# Altium schematic sheet Raspberry.SchDoc
size A4; SheetNumber: 3; SheetTotal: 6; SPICEModelCacheFICJDGAN: <root> / <DocumentId>FICJDGAN</DocumentId> / <CacheFrame Number="0"> / <Model Name="irlz44n" Kind="CKT"> / <Text>.SUBCKT irlz44n 1 2 3 / ************************************** / *      Model Generated by MODPEX     * / *Copyright(c) Symmetry Design Systems* / *         All Rights Reserved        * / *    UNPUBLISHED LICENSED SOFTWARE   * / *   Contains Proprietary Information * / *      Which is The Property of      * / *     SYMMETRY OR ITS LICENSORS      * / *Commercial Use or Resale Restricted * / *   by Symmetry License Agreement    * / ************************************** / * Model generated on Apr 24, 96 / * Model format: SPICE3 / * Symmetry POWER MOS Model (Version 1.0) / * External Node Designations / * Node 1 -&gt; Drain / * Node 2 -&gt; Gate / * Node 3 -&gt; Source / M1 9 7 8 8 MM L=100u W=100u / * Default values used in MM: / * The voltage-dependent capacitances are / * not included. Other default values are: / *   RS=0 RD=0 LD=0 CBD=0 CBS=0 CGBO=0 / .MODEL MM NMOS LEVEL=1 IS=1e-32 / +VTO=2.08819 LAMBDA=0.0038193 KP=67.9211 / +CGSO=1.59143e-05 CGDO=3.04562e-08 / RS 8 3 0.014066 / D1 3 1 MD / .MODEL MD D IS=4.4574e-09 RS=0.007275 N=1.40246 BV=55 / +IBV=0.00025 EG=1.14011 XTI=3.00078 TT=0 / +CJO=8.92434e-10 VJ=4.94724 M=0.75496 FC=0.5 / RDS 3 1 2.2e+06 / RD 9 1 0.00179971 / RG 2 7 2.4114 / D2 4 5 MD1 / * Default values used in MD1: / *   RS=0 EG=1.11 XTI=3.0 TT=0 / *   BV=infinite IBV=1mA / .MODEL MD1 D IS=1e-32 N=50 / +CJO=1.15401e-09 VJ=0.859156 M=0.642548 FC=1e-08 / D3 0 5 MD2 / * Default values used in MD2: / *   EG=1.11 XTI=3.0 TT=0 CJO=0 / *   BV=infinite IBV=1mA / .MODEL MD2 D IS=1e-10 N=0.4 RS=3e-06 / RL 5 10 1 / FI2 7 9 VFI2 -1 / VFI2 4 0 0 / EV16 10 0 9 7 1 / CAP 11 10 3.64838e-09 / FI1 7 9 VFI1 -1 / VFI1 11 6 0 / RCAP 6 10 1 / D4 0 6 MD3 / * Default values used in MD3: / *   EG=1.11 XTI=3.0 TT=0 CJO=0 / *   RS=0 BV=infinite IBV=1mA / .MODEL MD3 D IS=1e-10 N=0.4 / .ENDS</Text> / </Model> / <Model Name="di_1n4001" Kind="MDL"> / <Text>*************************************************************************************************************************************** / *SRC=1N4001;DI_1N4001;Diodes;Si;  50.0V  1.00A  3.00us   Diodes, Inc. diode / .MODEL DI_1N4001 D  ( IS=76.9p RS=42.0m BV=50.0 IBV=5.00u / + CJO=39.8p  M=0.333 N=1.45 TT=4.32u )</Text> / </Model> / </CacheFrame> / </root>
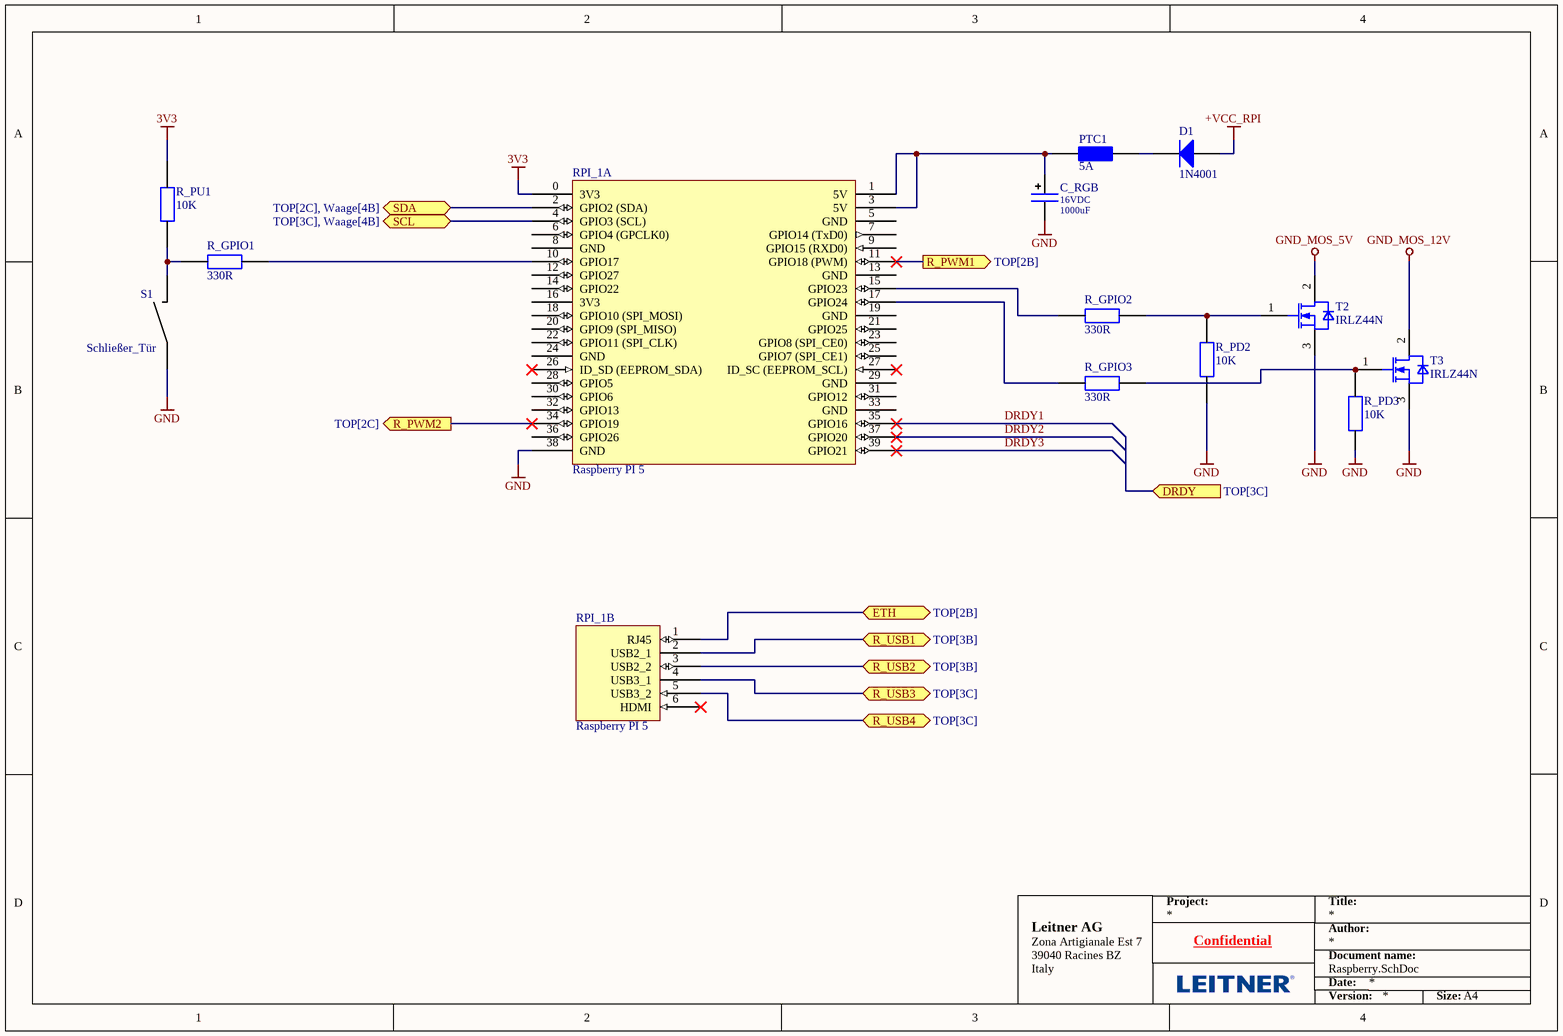
[diagram p0: Raspberry.SchDoc]

## Parts
C_RGB  Spannung: 16VDC  (hidden comment: 1000uF)
D1  1N4001  [D_DO41-RM4]
PTC1  5A
R_GPIO1  330R
R_GPIO2  330R
R_GPIO3  330R
R_PD2  10K
R_PD3  10K
R_PU1  10K
RPI_1  Raspberry PI 5  (parts A,B of 2)
S1  Schließer_Tür
T2  IRLZ44N
T3  IRLZ44N

## Ports
DRDY (in, see TOP[3C]), ETH (bidir, see TOP[2B]), R_PWM1 (out, see TOP[2B]), R_PWM2 (out, see TOP[2C]), R_USB1 (bidir, see TOP[3B]), R_USB2 (bidir, see TOP[3B]), R_USB3 (bidir, see TOP[3C]), R_USB4 (bidir, see TOP[3C]), SCL (bidir, see TOP[3C], Waage[4B]), SDA (bidir, see TOP[2C], Waage[4B])

## Nets
3V3: R_PU1.1 RPI_1.0(3V3)
+VCC_RPI: D1.A
GND: C_RGB.0 R_PD2.0 R_PD3.0 RPI_1.38(GND) T2.3(SOURCE) T3.3(SOURCE)
GND_MOS_5V: T2.2(DRAIN)
GND_MOS_12V: T3.2(DRAIN)
DRDY1: RPI_1.35(GPIO16)
DRDY2: RPI_1.37(GPIO20)
DRDY3: RPI_1.39(GPIO21)
ETH: RPI_1.1(RJ45) ; port ETH
R_PWM1: RPI_1.11(GPIO18_(PWM)) ; port R_PWM1
R_PWM2: RPI_1.34(GPIO19) ; port R_PWM2
R_USB1: RPI_1.2(USB2_1) ; port R_USB1
R_USB2: RPI_1.3(USB2_2) ; port R_USB2
R_USB3: RPI_1.4(USB3_1) ; port R_USB3
R_USB4: RPI_1.5(GND) ; port R_USB4
SCL: RPI_1.4(GPIO3_(SCL)) ; port SCL
SDA: RPI_1.2(GPIO2_(SDA)) ; port SDA
NetC_RGB_1: C_RGB.1 PTC1.0 RPI_1.1(5V) RPI_1.3(5V)
NetD1_C: D1.C(K) PTC1.1
NetR_GPIO1_0: R_GPIO1.0 R_PU1.0
NetR_GPIO1_1: R_GPIO1.1 RPI_1.10(GPIO17)
NetR_GPIO2_0: R_GPIO2.0 RPI_1.15(GPIO23)
NetR_GPIO2_1: R_GPIO2.1 R_PD2.1 T2.1(GATE)
NetR_GPIO3_0: R_GPIO3.0 RPI_1.17(GPIO24)
NetR_GPIO3_1: R_GPIO3.1 R_PD3.1 T3.1(GATE)

Not connected (* = marked no-connect by the designer): RPI_1 6(GPIO4_(GPCLK0)) 7(GPIO14_(TxD0)) 8(GND) 9(GPIO15_(RXD0)) 12(GPIO27) 13(GND) 14(GPIO22) 16(3V3) 18(GPIO10_(SPI_MOSI)) 19(GND) 20(GPIO9_(SPI_MISO)) 21(GPIO25) 22(GPIO11_(SPI_CLK)) 23(GPIO8_(SPI_CE0)) 24(GND) 25(GPIO7_(SPI_CE1)) 26(ID_SD_(EEPROM_SDA))* 27(ID_SC_(EEPROM_SCL))* 28(GPIO5) 29(GND) 30(GPIO6) 31(GPIO12) 32(GPIO13) 33(GND) 36(GPIO26)

## Notes on the sheet
- Project:
- Title:
- Leitner AG
- Zona Artigianale Est 7
- 39040 Racines BZ
- Italy
- Confidential
- Author:
- Document name:
- Date:
- Version:
- Size:
- A4

## Library data of the parts
C_RGB = Elko 1000uF: Ladung: 1000uF
D1 = 1N4001: Si-Diode; 50V, 1.00A, 3.00us (Diodes, Inc.); Usage: only permitted for non-commercial purposes at HTL I Innsbruck; SimulationModellSource: Diodes Incorporated; Published: 21-Feb-2011; LatestRevisionDate: 01-Nov-2012
PTC1 = PTC 5A: Current: 5A
R_GPIO1-R_GPIO3 = R 330: Widerstand: 330R
R_PD2 R_PD3 R_PU1 = R 10K: Widerstand: 10K
RPI_1 = Raspberry PI
S1 = S_Schließer
T2 T3 = IRLZ44N: OptiMOS 3 Power-Transistor, VDS 100V; Manufacturer: Infineon Technologies; Manufacturer Order Number: IRLZ44N; PackageReference: PG-TO220-3-904